# Altium schematic sheet SoundBlock.SchDoc
size A4
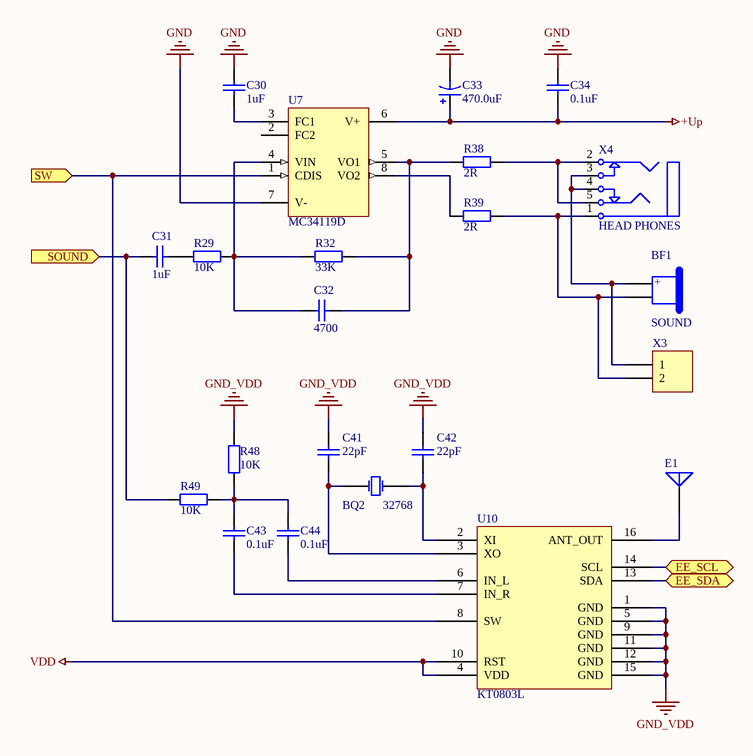
[diagram p0: SoundBlock.SchDoc]

## Parts
BF1  SOUND  [HCM12A]
BQ2  32768  [HC-49/U3H (low profile)]
C30  1uF  [1206_SMD_Capacitor]
C31  1uF  [1206_SMD_Capacitor]
C32  4700  [1206_SMD_Capacitor]
C33  470.0uF  [E]
C34  0.1uF  [1206_SMD_Capacitor]
C41  22pF  [0805]
C42  22pF  [0805]
C43  0.1uF  [0805]
C44  0.1uF  [0805]
E1  Antenna  [PIN1]  (value not drawn)
R29  10K  [1206_SMD_Resistor]
R32  33K  [1206_SMD_Resistor]
R38  2R  [1206_SMD_Resistor]
R39  2R  [1206_SMD_Resistor]
R48  10K  [1206_SMD_Resistor]
R49  10K  [1206_SMD_Resistor]
U7  MC34119D  [SO-8]
U10  KT0803L  [SOIC16N_M]
X3  SOUND  [HDR1X2]  (value not drawn)
X4  HEAD PHONES  [Audio from Aliexpress]

## Ports
EE_SCL (bidir), EE_SDA, SOUND (in), SW (in)

## Nets
+Up: C33.1 C34.1 U7.6(V+)
GND: C30.1 C33.2 C34.2 U7.7(V-)
GND_VDD: C41.2 C42.2 R48.2 U10.1(GND) U10.5(GND) U10.9(GND) U10.11(GND) U10.12(GND) U10.15(GND)
VDD: U10.4(VDD) U10.10(RST)
EE_SCL: U10.14(SCL) ; port EE_SCL
EE_SDA: U10.13(SDA) ; port EE_SDA
SOUND: C31.1 R49.1 ; port SOUND
SW: U7.1(CDIS) U10.8(SW) ; port SW
NetBF1_1: BF1.1 X3.1 X4.3 X4.4
NetBF1_2: BF1.2 R39.2 X3.2 X4.1
NetBQ2_1: BQ2.1(OSC1) C42.1 U10.2(XI)
NetBQ2_2: BQ2.2(OSC2) C41.1 U10.3(XO)
NetC30_2: C30.2 U7.3(FC1)
NetC31_2: C31.2 R29.1
NetC32_1: C32.1 R29.2 R32.1 U7.4(VIN)
NetC32_2: C32.2 R32.2 R38.1 U7.5(VO1)
NetC43_1: C43.1 U10.7(IN_R)
NetC43_2: C43.2 C44.2 R48.1 R49.2
NetC44_1: C44.1 U10.6(IN_L)
NetE1_1: E1.1(A) U10.16(ANT_OUT)
NetR38_2: R38.2 X4.2 X4.5
NetR39_1: R39.1 U7.8(VO2)

Not connected (* = marked no-connect by the designer): U7 2(FC2)

## Notes on the sheet
- (in symbol Elrctro-Magnetic Sound Generator) +

## Library data of the parts
BF1 = Elrctro-Magnetic Sound Generator: Magnetic Transducer Buzzer; Published: 24-Mar-1999; LatestRevisionDate: 17-Dec-2003; LatestRevisionNote: Schematic revised, PCB Footprint replaced.; DatasheetVersion: 17-Dec-2003; PackageReference: ABSM-1574; Publisher: Altium Limited; PackageDescription: Magnetic Transducer Buzzer; ComponentLink1Description: Manufacturer Link; ComponentLink1URL: http://www.megastar.com/linecard/buzzmode/index.php
BQ2 = XTAL: Crystal Oscillator; Frequence: 8,0 MHz; Published: 8-Jun-2000; LatestRevisionDate: 17-Jul-2002; LatestRevisionNote: Re-released for DXP Platform.; PackageReference: R38; Publisher: Altium Limited; PackageDescription: Crystal, Thru-Hole; 2 Leads; Body 3.1 x 8.2 mm (Dia.xH)
C30-C32 C34 C41-C44 = Capacitor SMD: Capacitor; Published: 8-Jun-2000; LatestRevisionDate: 17-Jul-2002; LatestRevisionNote: Re-released for DXP Platform.; PackageReference: RAD-0.3; Publisher: Altium Limited
  C30 C31: Value: 1uF
  C32: Value: 4700
  C34 C43 C44: Value: 0.1uF
  C41 C42: Value: 22pF
C33 = Cap Pol1: Polarized Capacitor (Radial); Published: 8-Jun-2000; LatestRevisionDate: 17-Jul-2002; LatestRevisionNote: Re-released for DXP Platform.; PackageReference: RB7.6-15; Publisher: Altium Limited; PackageDescription: Polarized Capacitor (Radial); 2 Leads; Value: 470.0uF
E1 = Antenna: Generic Antenna; Published: 24-Mar-1999; LatestRevisionDate: 17-Jul-2002; LatestRevisionNote: Re-released for DXP Platform.; PackageReference: PIN1; Publisher: Altium Limited
R29 R32 R38 R39 R48 R49 = Resistor
  R29: Published: 8-Jun-2000; LatestRevisionDate: 17-Jul-2002; LatestRevisionNote: Re-released for DXP Platform.; PackageReference: AXIAL-0.4; Publisher: Altium Limited; PackageDescription: Axial Device, Thru-Hole; 2 Leads; 0.4 in Pin Spacing; Value: 10K
  R32: Published: 8-Jun-2000; LatestRevisionDate: 17-Jul-2002; LatestRevisionNote: Re-released for DXP Platform.; PackageReference: AXIAL-0.4; Publisher: Altium Limited; PackageDescription: Axial Device, Thru-Hole; 2 Leads; 0.4 in Pin Spacing; Value: 33K
  R38 R39: Published: 8-Jun-2000; LatestRevisionDate: 17-Jul-2002; LatestRevisionNote: Re-released for DXP Platform.; PackageReference: AXIAL-0.4; Publisher: Altium Limited; PackageDescription: Axial Device, Thru-Hole; 2 Leads; 0.4 in Pin Spacing; Value: 2R
  R48 R49: Published: 31-Aug-2014; Publisher: Dmitry Kuzmin; Value: 10K
U7 = MC34119D: Low-Power Audio Amplifier; Published: 17-Jul-2002; LatestRevisionDate: 13-Apr-2006; LatestRevisionNote: IPC-7351 Footprint Added.; DatasheetVersion: 1989; PackageReference: 751-03; Publisher: Altium Limited; PackageDescription: 8-Pin Small Outline Integrated Circuit 1.27 mm Pitch; Code_JEDEC: MS-012-AA; Code_IPC: SOIC127P600-8
X3 = Header 2: Header, 2-Pin; LatestRevisionDate: 17-Jul-2002; LatestRevisionNote: Re-released for DXP Platform.; Publisher: Altium Limited
X4 = Phonejack Stereo SW: 3-Conductor Jack with 2 break contacts (normals) and 2 auxiliary make contacts; LatestRevisionDate: 17-Dec-2003; LatestRevisionNote: PCB Footprint replaced.; Publisher: Altium Limited; Published: 5-Jan-2004; DatasheetDocument: 07-Mar-2000; ComponentLink1Description: Manufacturer Link; ComponentLink1URL: http://domino.kycon.com/internet/Products.html